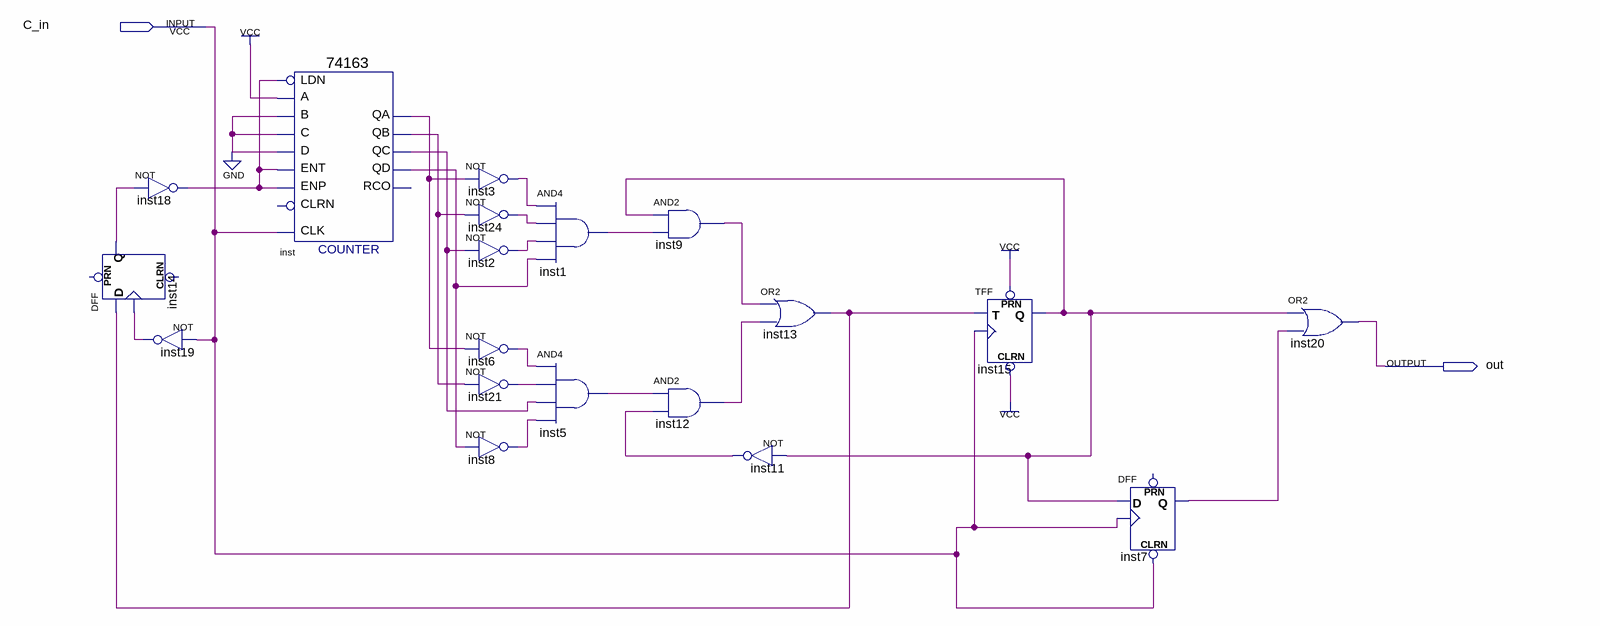
[diagram p0: schematic sheet]
// Quartus schematic FrequencyDividerBlock.bdf as structural Verilog: 19 symbols, 2 pins
module FrequencyDividerBlock (
  input  C_in,
  output out
);

  wire inst1_out, inst2_out, inst3_out, inst5_out, inst6_out, inst7_q, inst8_out, inst9_out, inst11_out,
       inst12_out, inst13_out, inst14_q, inst15_q, inst18_out, inst19_out, inst21_out, inst24_out, inst_qa,
       inst_qb, inst_qc, inst_qd;

  DFF inst14 (.CLK(inst19_out), .D(inst13_out), .Q(inst14_q));  // open: CLRN, PRN
  not inst18 (inst18_out, inst14_q);
  not inst19 (inst19_out, C_in);
  \74163  inst (
    .C(1'b0), .B(1'b0), .A(1'b1), .ENT(inst18_out), .D(1'b0), .CLK(C_in), .ENP(inst18_out), .LDN(inst18_out),
    .QA(inst_qa), .QB(inst_qb), .QC(inst_qc), .QD(inst_qd));  // open: CLRN, RCO
  not inst3 (inst3_out, inst_qa);
  not inst24 (inst24_out, inst_qb);
  not inst2 (inst2_out, inst_qc);
  not inst6 (inst6_out, inst_qa);
  not inst21 (inst21_out, inst_qb);
  not inst8 (inst8_out, inst_qd);
  and inst1 (inst1_out, inst3_out, inst24_out, inst2_out, inst_qd);
  and inst5 (inst5_out, inst6_out, inst21_out, inst_qc, inst8_out);
  and inst9 (inst9_out, inst15_q, inst1_out);
  and inst12 (inst12_out, inst5_out, inst11_out);
  not inst11 (inst11_out, inst15_q);
  or inst13 (inst13_out, inst9_out, inst12_out);
  TFF inst15 (.PRN(1'b1), .CLRN(1'b1), .T(inst13_out), .CLK(C_in), .Q(inst15_q));
  DFF inst7 (.CLRN(C_in), .CLK(C_in), .D(inst15_q), .Q(inst7_q));  // open: PRN
  or inst20 (out, inst15_q, inst7_q);
endmodule
